# Altium schematic sheet MCU_DBG.SchDoc
size A4; Organization: Altium Limited; Address1: L3, 12a Rodborough Rd; Address2: Frenchs Forest; Address3: NSW; Address4: Australia 2086; SheetNumber: 5; SheetTotal: 5
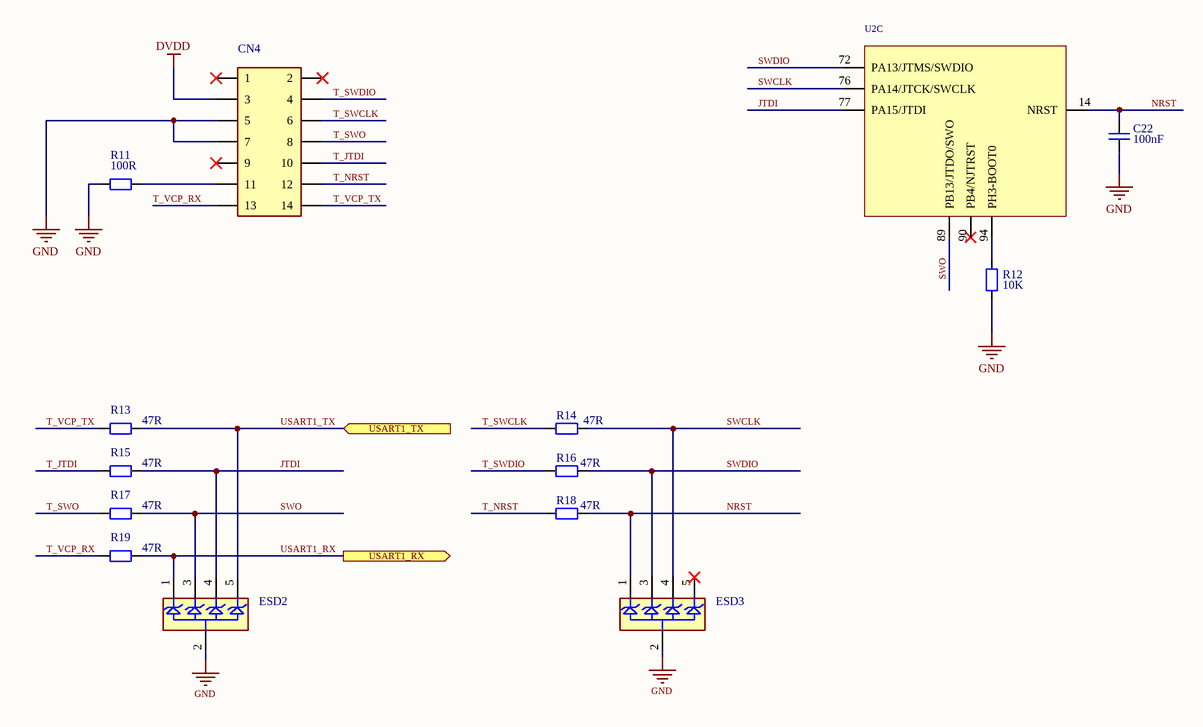
[diagram p0: MCU_DBG.SchDoc]

## Parts
C22  100nF  [CAP_SM0805_YAGEOCC2_N]
CN4  20021511-00014T4LF  [2002151100014T4LF]  (value not drawn)
ESD2  ESDALC6V1W5  [ESDALC6V1W5]  (value not drawn)
ESD3  ESDALC6V1W5  [ESDALC6V1W5]  (value not drawn)
R11  100R  [RES_SM0805_YAGEORC_N]
R12  10K  [RES_SM0805_YAGEORC_N]
R13  47R  [RES_SM0805_YAGEORC_N]
R14  47R  [RES_SM0805_YAGEORC_N]
R15  47R  [RES_SM0805_YAGEORC_N]
R16  47R  [RES_SM0805_YAGEORC_N]
R17  47R  [RES_SM0805_YAGEORC_N]
R18  47R  [RES_SM0805_YAGEORC_N]
R19  47R  [RES_SM0805_YAGEORC_N]
U2  STM32U575VI_1  [STM32U575VI]  (value not drawn)  (part C of 3)

## Ports
USART1_RX (out), USART1_TX (in)

## Nets
DVDD: CN4.3
GND: C22.2 CN4.5 CN4.7 ESD2.2(GND) ESD3.2(GND) R11.1 R12.1
JTDI: ESD2.4(I/03) R15.2 U2.77(PA15/JTDI)
NRST: C22.1 ESD3.1(I/01) R18.2 U2.14(NRST)
SWCLK: ESD3.4(I/03) R14.2 U2.76(PA14/JTCK/SWCLK)
SWDIO: ESD3.3(I/02) R16.2 U2.72(PA13/JTMS/SWDIO)
SWO: ESD2.3(I/02) R17.2 U2.89(PB13/JTDO/SWO)
T_JTDI: CN4.10 R15.1
T_NRST: CN4.12 R18.1
T_SWCLK: CN4.6 R14.1
T_SWDIO: CN4.4 R16.1
T_SWO: CN4.8 R17.1
T_VCP_RX: CN4.13 R19.1
T_VCP_TX: CN4.14 R13.1
USART1_RX: ESD2.1(I/01) R19.2 ; port USART1_RX
USART1_TX: ESD2.5(I/04) R13.2 ; port USART1_TX
NetCN4_11: CN4.11 R11.2
NetR12_2: R12.2 U2.94(PH3-BOOT0)

Not connected (* = marked no-connect by the designer): CN4 1* 2* 9*; ESD3 5(I/04)*; U2 90(PB4/NJTRST)*

## Notes on the sheet
- Title:
- Size: A4
- Date:
- FMC-320U MODEL A
- Sheet:
- Time:
- Of:
- Version:
- Revision:
- Release:
- 1
- 0
- FLOWMEET SRL
- File

## Library data of the parts
C22 = CC0805KRX7R9BB104: CAP 100nF SM0805 X7R 50V YAGEO CC2; Tolerance (%): 10; Voltage Rating (Volts): 50; Category: Capacitor; Manufacturer: Yageo; Manufacturer Part Number: CC0805KRX7R9BB104; Package: 0805; Value: 100nF; Supplier Part Number 1: 3019949; Supplier 1: Farnell; ComponentLink1URL: http://www.yageo.com; ComponentLink1Description: Manufacturer Website; Supplier 2: Digi-Key; Supplier Part Number 2: 311-1140-1-ND
CN4 = 20021511-00014T4LF: 1.27mm (0.05in.) pitch, Shrouded header, 14 contacts; Manufacturer: Amphenol ICC; Manufacturer Part Number: 20021511-00014T4LF; Category: Header Shrouded; Datasheet: https://cdn.amphenol-cs.com/media/wysiwyg/files/drawing/20021511.pdf
ESD2 ESD3 = ESDALC6V1W5: TVS Diode Array Uni-Directional 6.1V / QTY 5 per pack, SOT-323 / Ranking 5: / Marca reconocida. / Usado en placas nucleo, sometidas a manipuleo nunca note un pin quemado por ESD.; Manufacturer: ST; ComponentLink1Description: Datasheet; ComponentLink1URL: *; Manufacturer Part Number: ESDALC6V1W5; Category: Diodo; Datasheet: https://www.st.com/content/ccc/resource/technical/document/datasheet/32/30/02/e6/ac/0f/46/c2/CD00002946.pdf/files/CD00002946.pdf/jcr:content/translations/en.CD00002946.pdf
R11 = RC0805FR-07100RL: RES 100R SM0805 YAGEO RC_L; Power (Watts): 0.125; Resistance (Ohms): 100; Tolerance (%): 1; Category: Resistor; Manufacturer: Yageo; Manufacturer Part Number: RC0805FR-07100RL; Package: 0805; Value: 100R; Supplier Part Number 1: 9237364; Supplier 1: Farnell; ComponentLink1Description: Manufacturer Website; ComponentLink1URL: http://www.yageo.com; Supplier 2: Digi-Key; Supplier Part Number 2: 311-100CRCT-ND
R12 = RC0805FR-0710KL: RES 10K SM0805 YAGEO RC_L; Power (Watts): 0.125; Resistance (Ohms): 10000; Tolerance (%): 1; Category: Resistor; Manufacturer: Yageo; Manufacturer Part Number: RC0805FR-0710KL; Package: 0805; Value: 10K; Supplier Part Number 1: 9237755; Supplier 1: Farnell; ComponentLink1Description: Manufacturer Website; ComponentLink1URL: http://www.yageo.com; Supplier 2: Digi-Key; Supplier Part Number 2: 311-10.0KCRCT-ND
R13-R19 = RC0805FR-0747RL: RES 47R SM0805 YAGEO RC_L; Power (Watts): 0.125; Resistance (Ohms): 47; Tolerance (%): 1; Category: Resistor; Manufacturer: Yageo; Manufacturer Part Number: RC0805FR-0747RL; Package: 0805; Value: 47R; Supplier Part Number 1: 9237321; Supplier 1: Farnell; ComponentLink1Description: Manufacturer Website; ComponentLink1URL: http://www.yageo.com; Supplier 2: Digi-Key; Supplier Part Number 2: 311-47.0CRCT-ND
U2 = STM32U575VI_1: Manufacturer: ST; Manufacturer Part Number: STM32U575VIT6Q; Category: Microcontrolador; Datasheet: https://www.st.com/resource/en/datasheet/stm32u575ag.pdf